# Altium schematic sheet Driver_LED.SchDoc
size 76 x 50 mm
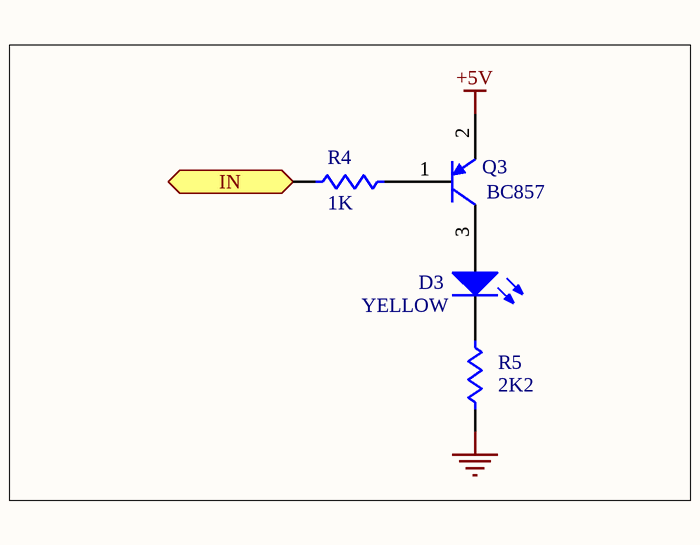
[diagram p0: Driver_LED.SchDoc]

## Parts
D3  YELLOW  [0805_Diode]
Q3  BC857  [SOT23-3N]
R4  1K  [0805]
R5  2K2  [0805]

## Ports
IN (in)

## Nets
+5V: Q3.2(E)
GND: R5.1
IN: R4.2 ; port IN
NetD3_1: D3.1(A) Q3.3(C)
NetD3_2: D3.2(K) R5.2
NetQ3_1: Q3.1(B) R4.1

## Library data of the parts
D3 = Optical Transmitter: Typical INFRARED GaAs LED; Manufacturer: Generic Components; Class I: Optoelectronic; Published: 8-Jun-2000; Revision: July-2002: Re-released for DXP Platform.; Publisher: Altium Limited; Class II: LED
Q3 = BC857: Silicon Bipolar Transistor
R4 R5 = Res1: Resistor; Manufacturer: Generic Components; Class I: Passive; Published: 8-Jun-2000; Revision: July-2002: Re-released for DXP Platform.; Publisher: Altium Limited; Class II: Resistor